# Altium schematic sheet ADC.SchDoc: HPBI Controller
size B; ApprovedBy: J Johnson; CheckedBy: J Johnson; Author: sdfasdfdfAEFfasdFfaF; DrawnBy: J Johnson; Organization: Opsero Electronic Design; Address1: 21-915 Av. Marguerite-Bourgeoys; Address2: Québec (QC); Address3: G1S 3X4; DocumentNumber: OP009-001-SCH; Revision: 1.0; SheetNumber: 15; SheetTotal: 16; Tel1: (581) 308-8830; Tel2: (581) 308-8830; Project: HPBI Controller; CheckedDate: 2013-12-13; Sheet: ADC 3Msps 12-bit 16-channel; PageSetup: Record=PageOptions|CenterHorizontal=True|CenterVertical=True|PrintScale=1.08|XCorrection=1.00|YCorrection=1.00|PrintKind=0|BorderSize=5000000|LeftOffset=0|BottomOffset=0|Orientation=2|PaperLength=1000|PaperWidth=1000|Scale=100|PaperSource=7|PrintQuality=-4|MediaType=1|DitherType=10|PaperKind=Tabloid     [11 x 17 in]|PrintScaleMode=1; DrawDate: 2013-12-13; SchTitle: HPBI Controller; RevDescription: Preliminary; RevDate: 2014-01-29; RevBy: J Johnson
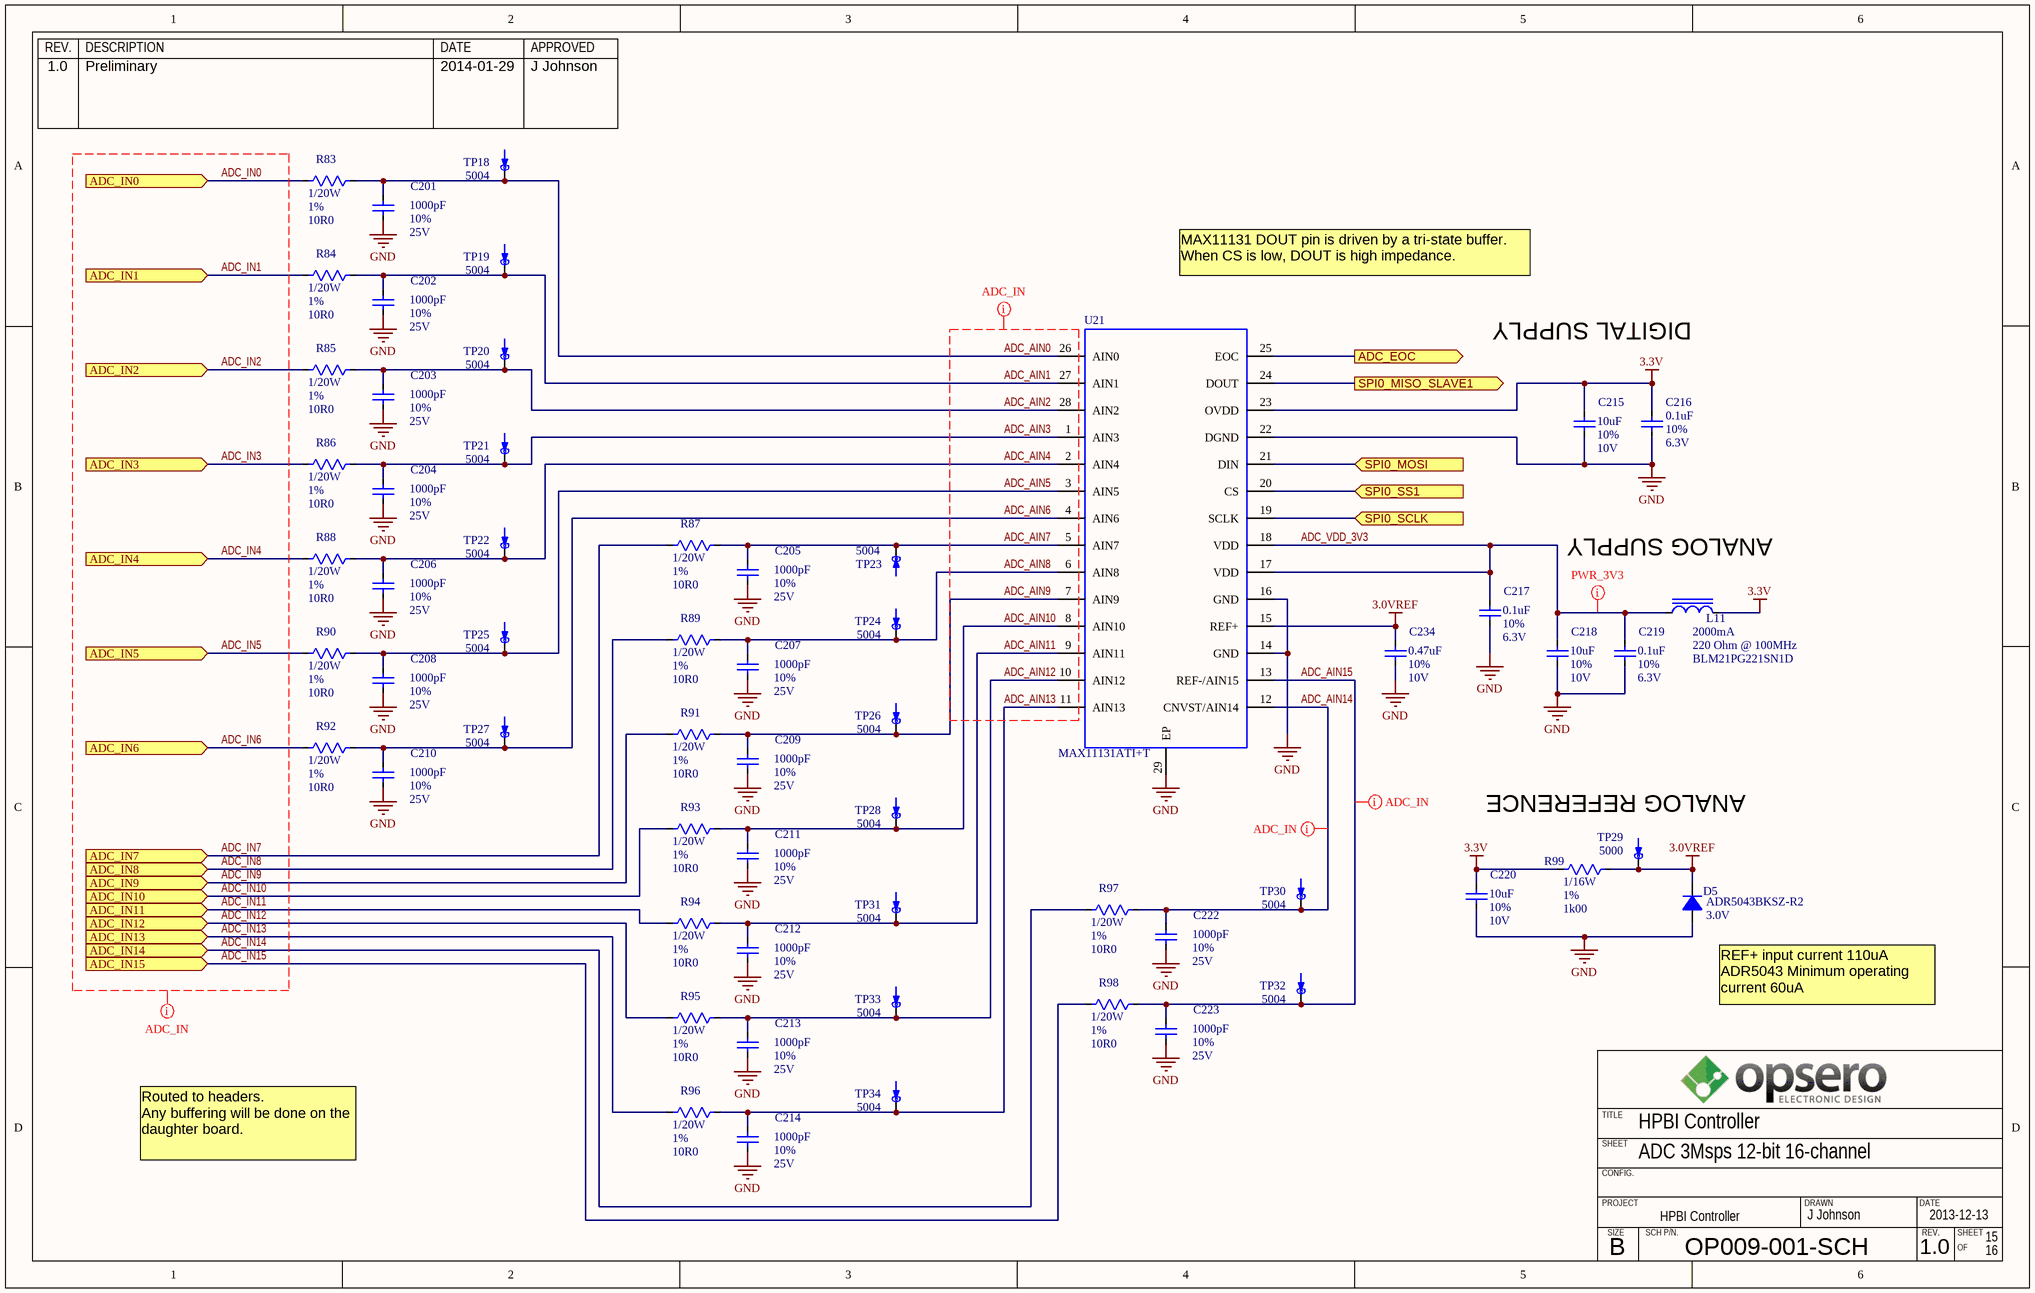
[diagram p0: ADC.SchDoc]

## Parts
C201  value 1000pF  Tolerance: 10%  Voltage: 25V  [CAPC0603X33N]  (hidden comment: CAPACITOR_NP_TYPE1)
C202  value 1000pF  Tolerance: 10%  Voltage: 25V  [CAPC0603X33N]  (hidden comment: CAPACITOR_NP_TYPE1)
C203  value 1000pF  Tolerance: 10%  Voltage: 25V  [CAPC0603X33N]  (hidden comment: CAPACITOR_NP_TYPE1)
C204  value 1000pF  Tolerance: 10%  Voltage: 25V  [CAPC0603X33N]  (hidden comment: CAPACITOR_NP_TYPE1)
C205  value 1000pF  Tolerance: 10%  Voltage: 25V  [CAPC0603X33N]  (hidden comment: CAPACITOR_NP_TYPE1)
C206  value 1000pF  Tolerance: 10%  Voltage: 25V  [CAPC0603X33N]  (hidden comment: CAPACITOR_NP_TYPE1)
C207  value 1000pF  Tolerance: 10%  Voltage: 25V  [CAPC0603X33N]  (hidden comment: CAPACITOR_NP_TYPE1)
C208  value 1000pF  Tolerance: 10%  Voltage: 25V  [CAPC0603X33N]  (hidden comment: CAPACITOR_NP_TYPE1)
C209  value 1000pF  Tolerance: 10%  Voltage: 25V  [CAPC0603X33N]  (hidden comment: CAPACITOR_NP_TYPE1)
C210  value 1000pF  Tolerance: 10%  Voltage: 25V  [CAPC0603X33N]  (hidden comment: CAPACITOR_NP_TYPE1)
C211  value 1000pF  Tolerance: 10%  Voltage: 25V  [CAPC0603X33N]  (hidden comment: CAPACITOR_NP_TYPE1)
C212  value 1000pF  Tolerance: 10%  Voltage: 25V  [CAPC0603X33N]  (hidden comment: CAPACITOR_NP_TYPE1)
C213  value 1000pF  Tolerance: 10%  Voltage: 25V  [CAPC0603X33N]  (hidden comment: CAPACITOR_NP_TYPE1)
C214  value 1000pF  Tolerance: 10%  Voltage: 25V  [CAPC0603X33N]  (hidden comment: CAPACITOR_NP_TYPE1)
C215  value 10uF  Tolerance: 10%  Voltage: 10V  [CAPC1608X38N]  (hidden comment: CAPACITOR_NP_TYPE1)
C216  value 0.1uF  Tolerance: 10%  Voltage: 6.3V  [CAPC0603X33N]  (hidden comment: CAPACITOR_NP_TYPE1)
C217  value 0.1uF  Tolerance: 10%  Voltage: 6.3V  [CAPC0603X33N]  (hidden comment: CAPACITOR_NP_TYPE1)
C218  value 10uF  Tolerance: 10%  Voltage: 10V  [CAPC1608X38N]  (hidden comment: CAPACITOR_NP_TYPE1)
C219  value 0.1uF  Tolerance: 10%  Voltage: 6.3V  [CAPC0603X33N]  (hidden comment: CAPACITOR_NP_TYPE1)
C220  value 10uF  Tolerance: 10%  Voltage: 10V  [CAPC1608X38N]  (hidden comment: CAPACITOR_NP_TYPE1)
C222  value 1000pF  Tolerance: 10%  Voltage: 25V  [CAPC0603X33N]  (hidden comment: CAPACITOR_NP_TYPE1)
C223  value 1000pF  Tolerance: 10%  Voltage: 25V  [CAPC0603X33N]  (hidden comment: CAPACITOR_NP_TYPE1)
C234  value 0.47uF  Tolerance: 10%  Voltage: 10V  [CAPC1005X55N]  (hidden comment: CAPACITOR_NP_TYPE1)
D5  value 3.0V  Mfg Part Number 1: ADR5043BKSZ-R2  [SOT65P210X110-3N]  (hidden comment: DIODE_TYPE3)
L11  value 220 Ohm @ 100MHz  Current: 2000mA  Mfg Part Number 1: BLM21PG221SN1D  [INDC2012X85N]  (hidden comment: INDUCTOR_CORE_TYPE1)
R83  value 10R0  Power: 1/20W  Tolerance: 1%  [RESC1005X33N]  (hidden comment: *)
R84  value 10R0  Power: 1/20W  Tolerance: 1%  [RESC1005X33N]  (hidden comment: *)
R85  value 10R0  Power: 1/20W  Tolerance: 1%  [RESC1005X33N]  (hidden comment: *)
R86  value 10R0  Power: 1/20W  Tolerance: 1%  [RESC1005X33N]  (hidden comment: *)
R87  value 10R0  Power: 1/20W  Tolerance: 1%  [RESC1005X33N]  (hidden comment: *)
R88  value 10R0  Power: 1/20W  Tolerance: 1%  [RESC1005X33N]  (hidden comment: *)
R89  value 10R0  Power: 1/20W  Tolerance: 1%  [RESC1005X33N]  (hidden comment: *)
R90  value 10R0  Power: 1/20W  Tolerance: 1%  [RESC1005X33N]  (hidden comment: *)
R91  value 10R0  Power: 1/20W  Tolerance: 1%  [RESC1005X33N]  (hidden comment: *)
R92  value 10R0  Power: 1/20W  Tolerance: 1%  [RESC1005X33N]  (hidden comment: *)
R93  value 10R0  Power: 1/20W  Tolerance: 1%  [RESC1005X33N]  (hidden comment: *)
R94  value 10R0  Power: 1/20W  Tolerance: 1%  [RESC1005X33N]  (hidden comment: *)
R95  value 10R0  Power: 1/20W  Tolerance: 1%  [RESC1005X33N]  (hidden comment: *)
R96  value 10R0  Power: 1/20W  Tolerance: 1%  [RESC1005X33N]  (hidden comment: *)
R97  value 10R0  Power: 1/20W  Tolerance: 1%  [RESC1005X33N]  (hidden comment: *)
R98  value 10R0  Power: 1/20W  Tolerance: 1%  [RESC1005X33N]  (hidden comment: *)
R99  value 1k00  Power: 1/16W  Tolerance: 1%  [RESC1005X33N]  (hidden comment: *)
TP18  value 5004  [KEY_5004]  (hidden comment: TEST_POINT_TYPE4)
TP19  value 5004  [KEY_5004]  (hidden comment: TEST_POINT_TYPE4)
TP20  value 5004  [KEY_5004]  (hidden comment: TEST_POINT_TYPE4)
TP21  value 5004  [KEY_5004]  (hidden comment: TEST_POINT_TYPE4)
TP22  value 5004  [KEY_5004]  (hidden comment: TEST_POINT_TYPE4)
TP23  value 5004  [KEY_5004]  (hidden comment: TEST_POINT_TYPE4)
TP24  value 5004  [KEY_5004]  (hidden comment: TEST_POINT_TYPE4)
TP25  value 5004  [KEY_5004]  (hidden comment: TEST_POINT_TYPE4)
TP26  value 5004  [KEY_5004]  (hidden comment: TEST_POINT_TYPE4)
TP27  value 5004  [KEY_5004]  (hidden comment: TEST_POINT_TYPE4)
TP28  value 5004  [KEY_5004]  (hidden comment: TEST_POINT_TYPE4)
TP29  value 5000  [KEY_5000]  (hidden comment: TEST_POINT_TYPE4)
TP30  value 5004  [KEY_5004]  (hidden comment: TEST_POINT_TYPE4)
TP31  value 5004  [KEY_5004]  (hidden comment: TEST_POINT_TYPE4)
TP32  value 5004  [KEY_5004]  (hidden comment: TEST_POINT_TYPE4)
TP33  value 5004  [KEY_5004]  (hidden comment: TEST_POINT_TYPE4)
TP34  value 5004  [KEY_5004]  (hidden comment: TEST_POINT_TYPE4)
U21  MAX11131ATI+T  [TQFN50P500X500X75-28N]

## Ports
ADC_EOC (out), ADC_IN0 (in), ADC_IN1 (in), ADC_IN2 (in), ADC_IN3 (in), ADC_IN4 (in), ADC_IN5 (in), ADC_IN6 (in), ADC_IN7 (in), ADC_IN8 (in), ADC_IN9 (in), ADC_IN10 (in), ADC_IN11 (in), ADC_IN12 (in), ADC_IN13 (in), ADC_IN14 (in), ADC_IN15 (in), SPI0_MISO_SLAVE1 (out), SPI0_MOSI (in), SPI0_SCLK (in), SPI0_SS1 (in)

## Nets
3.0VREF: C234.1 D5.1(K) R99.2 TP29.1 U21.15(REF+)
3.3V: C215.1 C216.1 C220.1 L11.2 R99.1 U21.23(OVDD)
GND: C201.2 C202.2 C203.2 C204.2 C205.2 C206.2 C207.2 C208.2 C209.2 C210.2 C211.2 C212.2 C213.2 C214.2 C215.2 C216.2 C217.2 C218.2 C219.2 C220.2 C222.2 C223.2 C234.2 D5.2(A) U21.14(GND) U21.16(GND) U21.22(DGND) U21.29(EP)
ADC_AIN0: C201.1 R83.2 TP18.1 U21.26(AIN0)
ADC_AIN1: C202.1 R84.2 TP19.1 U21.27(AIN1)
ADC_AIN2: C203.1 R85.2 TP20.1 U21.28(AIN2)
ADC_AIN3: C204.1 R86.2 TP21.1 U21.1(AIN3)
ADC_AIN4: C206.1 R88.2 TP22.1 U21.2(AIN4)
ADC_AIN5: C208.1 R90.2 TP25.1 U21.3(AIN5)
ADC_AIN6: C210.1 R92.2 TP27.1 U21.4(AIN6)
ADC_AIN7: C205.1 R87.2 TP23.1 U21.5(AIN7)
ADC_AIN8: C207.1 R89.2 TP24.1 U21.6(AIN8)
ADC_AIN9: C209.1 R91.2 TP26.1 U21.7(AIN9)
ADC_AIN10: C211.1 R93.2 TP28.1 U21.8(AIN10)
ADC_AIN11: C212.1 R94.2 TP31.1 U21.9(AIN11)
ADC_AIN12: C213.1 R95.2 TP33.1 U21.10(AIN12)
ADC_AIN13: C214.1 R96.2 TP34.1 U21.11(AIN13)
ADC_AIN14: C222.1 R97.2 TP30.1 U21.12(CNVST/AIN14)
ADC_AIN15: C223.1 R98.2 TP32.1 U21.13(REF-/AIN15)
ADC_EOC: U21.25(EOC) ; port ADC_EOC
ADC_IN0: R83.1 ; port ADC_IN0
ADC_IN1: R84.1 ; port ADC_IN1
ADC_IN2: R85.1 ; port ADC_IN2
ADC_IN3: R86.1 ; port ADC_IN3
ADC_IN4: R88.1 ; port ADC_IN4
ADC_IN5: R90.1 ; port ADC_IN5
ADC_IN6: R92.1 ; port ADC_IN6
ADC_IN7: R87.1 ; port ADC_IN7
ADC_IN8: R89.1 ; port ADC_IN8
ADC_IN9: R91.1 ; port ADC_IN9
ADC_IN10: R93.1 ; port ADC_IN10
ADC_IN11: R94.1 ; port ADC_IN11
ADC_IN12: R95.1 ; port ADC_IN12
ADC_IN13: R96.1 ; port ADC_IN13
ADC_IN14: R97.1 ; port ADC_IN14
ADC_IN15: R98.1 ; port ADC_IN15
ADC_VDD_3V3: C217.1 C218.1 C219.1 L11.1 U21.17(VDD) U21.18(VDD)
SPI0_MISO_SLAVE1: U21.24(DOUT) ; port SPI0_MISO_SLAVE1
SPI0_MOSI: U21.21(DIN) ; port SPI0_MOSI
SPI0_SCLK: U21.19(SCLK) ; port SPI0_SCLK
SPI0_SS1: U21.20(CS) ; port SPI0_SS1

## Layout directives
net class Power_3V3: ADC_VDD_3V3
net class ADC_IN(0-15): ADC_AIN0, ADC_AIN1, ADC_AIN2, ADC_AIN3, ADC_AIN4, ADC_AIN5, ADC_AIN6, ADC_AIN7, ADC_AIN8, ADC_AIN9, ADC_AIN10, ADC_AIN11, ADC_AIN12, ADC_AIN13, ADC_AIN14, ADC_AIN15, ADC_IN0, ADC_IN1, ADC_IN2, ADC_IN3, ADC_IN4, ADC_IN5, ADC_IN6, ADC_IN7, ADC_IN8, ADC_IN9, ADC_IN10, ADC_IN11, ADC_IN12, ADC_IN13, ADC_IN14, ADC_IN15

## Notes on the sheet
- MAX11131 DOUT pin is driven by a tri-state buffer.
  When CS is low, DOUT is high impedance.
- DIGITAL SUPPLY
- ANALOG SUPPLY
- ANALOG REFERENCE
- (near D5) REF+ input current 110uA
  ADR5043 Minimum operating current 60uA
- Routed to headers.
  Any buffering will be done on the daughter board.
- REV.
- DESCRIPTION
- DATE
- APPROVED
- SHEET
- TITLE
- CONFIG.
- PROJECT
- SIZE
- SCH P/N.
- DRAWN
- B
- OF

## Library data of the parts
C201-C214 C222 C223 = C0201_1000pF_10%_25V_X5R: Capacitor ceramic, X5R, 1000pF, 25V, 10%, -55 to +85 C, EIA0201; Manufacturer 1: TDK; Mfg Part Number 1: C0603X5R1E102K030BA; EIA(I) Package: 0201; EIA(M) Package: 0603; ASSY: USED; Status: Active; Power: *; Current: *; Part Ref: C0201_1000pF_10%_25V_X5R; Comment_1: *; RoHs: True; Operating Temp: -55 to +85 C
C215 C218 C220 = C0603_10uF_10%_10V_X5R: Capacitor ceramic, X5R, 10uF, 10V, 10%, -55 to +85 C, EIA0603; Manufacturer 1: TDK Corporation; Mfg Part Number 1: C1608X5R1A106K080AC; EIA(I) Package: 0603; EIA(M) Package: 1608; ASSY: USED; Status: Active; Power: *; Current: *; Part Ref: C0603_10uF_10%_10V_X5R; Comment_1: *; RoHs: True; Operating Temp: -55 to +85 C
C216 C217 C219 = C0201_0.1uF_10%_6.3V_X5R: Capacitor ceramic, X5R, 0.1uF, 6.3V, 10%, -55 to +125 C, EIA0201; Manufacturer 1: Murata; Mfg Part Number 1: GRM033R60J104KE19D; EIA(I) Package: 0201; EIA(M) Package: 0603; ASSY: USED; Status: Active; Power: *; Current: *; Part Ref: C0201_0.1uF_10%_6.3V_X5R; Comment_1: *; RoHs: True; Operating Temp: -55 to +85 C
C234 = C0402_0.47uF_10%_10V_X5R: Capacitor ceramic, X5R, 0.47uF, 10V, 10%, -55 to +85 C, EIA0402; Manufacturer 1: MURATA; Mfg Part Number 1: GRM155R61A474KE15D; EIA(I) Package: 0402; EIA(M) Package: 1005; ASSY: USED; Status: Active; Power: *; Current: *; Part Ref: C0402_0.47uF_10%_10V_X5R; Comment_1: *; RoHs: True; Operating Temp: -55 to +85 C; Datasheet 1: ..\datasheet\Capacitor\Murata\GRM_Serie\GRM155R61A_X5R\2012-10-27
D5 = ADR5043BKSZ-R2: Reference Shunt 3.0V, 3-lead SC70; Manufacturer 1: Analog Devices; Current: 15mA; Tolerance: 0.1%; ASSY: USED; Status: Active; Power: *; EIA(I) Package: *; EIA(M) Package: *; Part Ref: ADR5043BKSZ-R2; Comment_1: *; RoHs: True; Package: SC70; Voltage: 3.0V; Operating Temp: -40 to +125 C
L11 = BLM21PG221SN1D: Ferrite chip, 220 Ohm @ 100MHz, 2000mA, 25%, -55 to +125 C, 0805; Manufacturer 1: Murata; EIA(I) Package: 0805; EIA(M) Package: 2012; ASSY: USED; Status: Active; Power: *; Part Ref: BLM21PG221SN1D; Voltage: *; Comment_1: *; RoHs: True; Tolerance: 25%; Operating Temp: -55 to +125 C
R83-R98 = R0201_10R0_1%: Resistor, 10R0, 1/20W, 1%, -50 to +155 C, EIA0201, EIA(M)0603; Manufacturer 1: Yageo; Mfg Part Number 1: RC0201FR-0710RL; EIA(I) Package: 0201; EIA(M) Package: 0603; Voltage: 50V; ASSY: USED; Status: Active; Part Ref: R0201_10R0_1%; Current: *; Comment_1: *; RoHs: True; Package: 0201; Operating Temp: -50 to +155 C
R99 = R0402_1k00_1%: Resistor, 1k00, 1/16W, 1%, -55 to +155 C, EIA0402; Manufacturer 1: Yageo; Mfg Part Number 1: RC0402FR-071K00L; EIA(I) Package: 0402; EIA(M) Package: 1005; Voltage: 50V; ASSY: USED; Status: Active; Part Ref: R0402_1k00_1%; Current: *; Comment_1: *; RoHs: True; Operating Temp: -55 to +155 C; Datasheet 1: ..\datasheet\Resistor\Yaego\Thick_Film\RC0402\2012-03-29; Manufacturer 2: Vishay Dale; Mfg Part Number 2: CRCW04021k00FKED; Datasheet 2: ..\datasheet\Resistor\Vishay Dale\CRC\2012-03-29
TP18-TP28 TP30-TP34 = 5004: Test point bead, yellow, Keystone Electronics, Thru-hole,; Manufacturer 1: Keystone inc; ASSY: USED; Power: Pow; Current: Cur; Voltage: Vol; Comment_1: Com; Status: Active; EIA(I) Package: *; EIA(M) Package: *; Part Ref: 5004; Tolerance: *; Package: *; RoHs: True; Mfg Part Number 1: 5004; Datasheet 1: ..\datasheet\Connector\Keystone Electronics\5001-5014\2012-06-28
TP29 = 5000: Test point bead, red, Keystone Electronics, Thru-hole,; Manufacturer 1: Keystone inc; ASSY: USED; Power: Pow; Current: Cur; Voltage: Vol; Comment_1: Com; Status: Active; EIA(I) Package: *; EIA(M) Package: *; Part Ref: 5000; Tolerance: *; Package: *; RoHs: True; Mfg Part Number 1: 5000; Datasheet 1: ..\datasheet\Connector\Keystone Electronics\5001-5014\2012-06-28
U21 = MAX11131ATI+T: ADC 12bit, 3Msps, 16 channels,2.35V to 3.6V, TQFN, -40 to +125 C; Manufacturer 1: Maxim; PART NUMBER: MAX11131ATI+T; Part Ref: MAX11131ATI+T; Status: Active; RoHs: True; Value: MAX11131ATI+T; Mfg Part Number 1: MAX11131ATI+T; Package: TQFN28